# EAGLE design untitled (EAGLE 9.6.2)
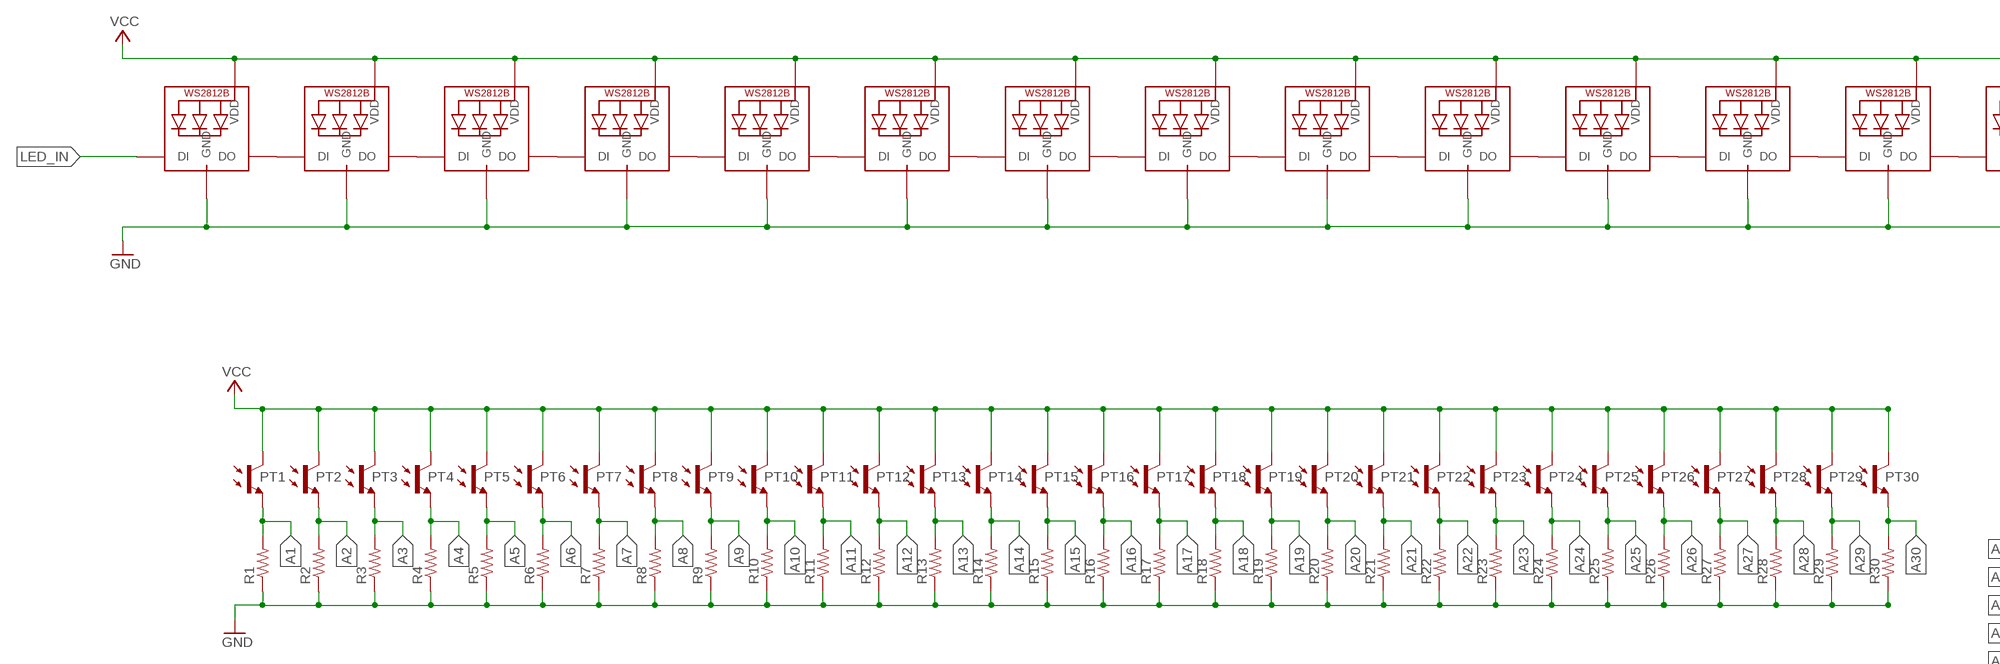
[diagram p0: schematic, sheet 1, part 1 of 2]
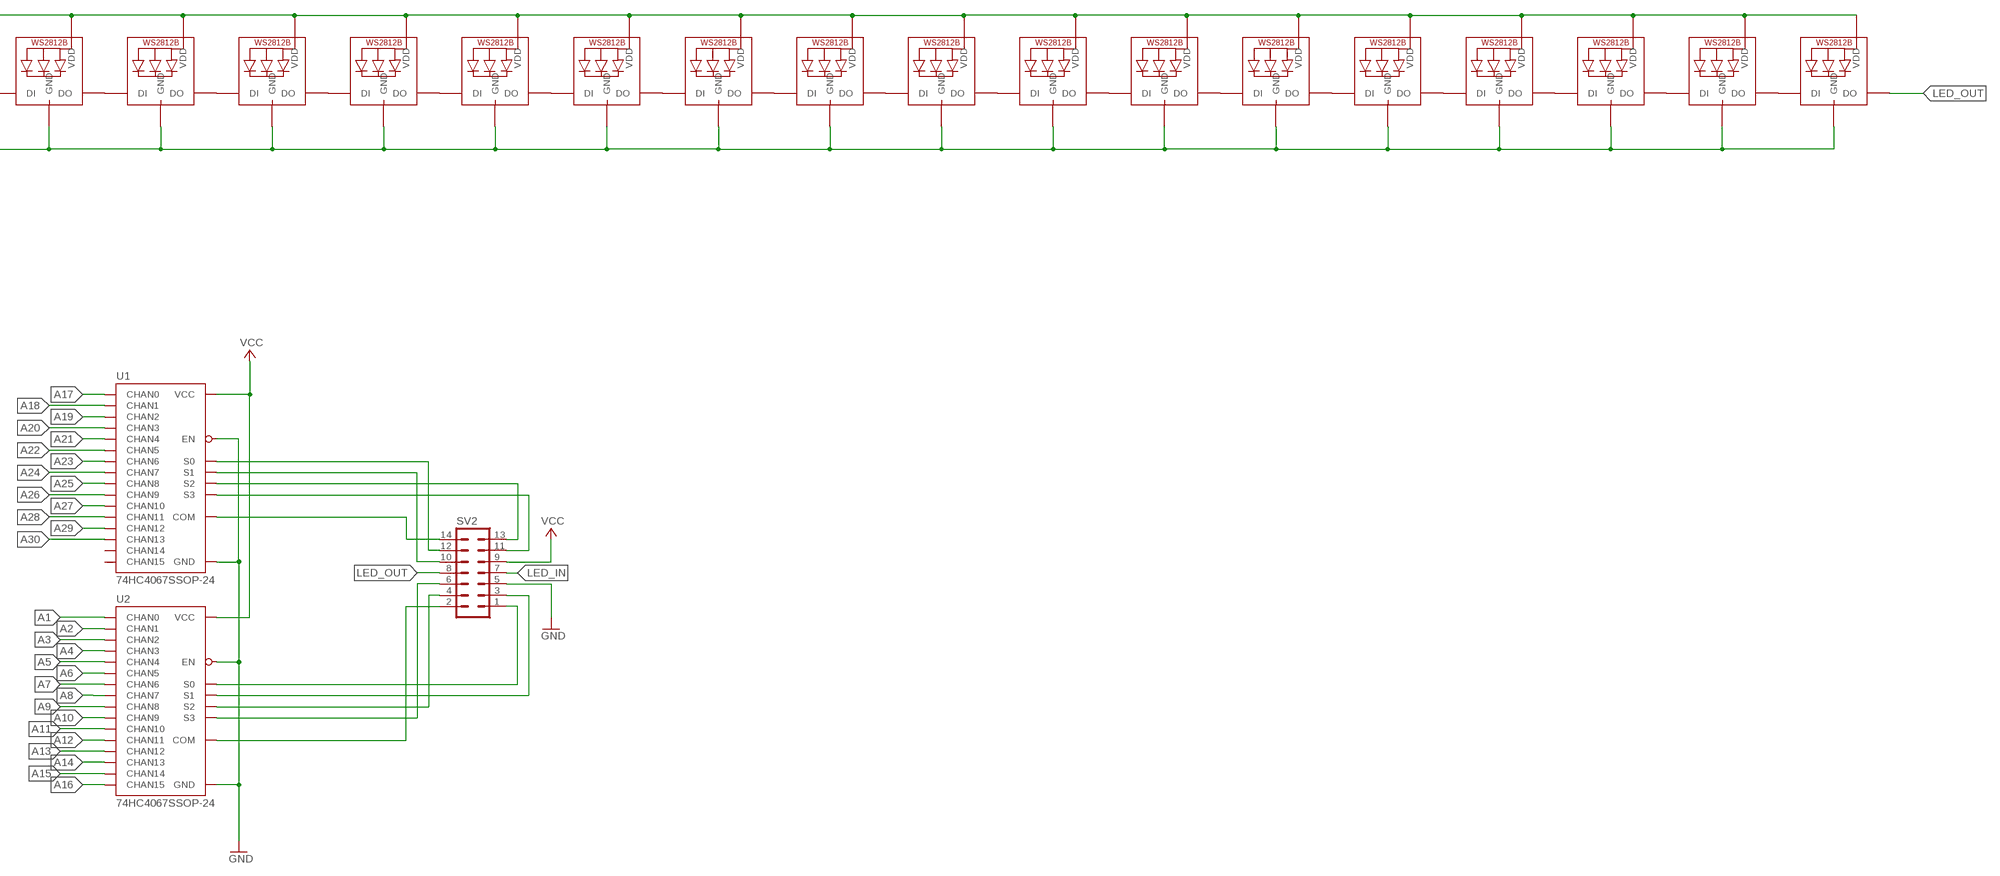
[diagram p1: schematic, sheet 1, part 2 of 2]

## Parts
LED1  WS2812B_5050N  [WS2812B-NARROW]
LED2  WS2812B_5050N  [WS2812B-NARROW]
LED3  WS2812B_5050N  [WS2812B-NARROW]
LED4  WS2812B_5050N  [WS2812B-NARROW]
LED5  WS2812B_5050N  [WS2812B-NARROW]
LED6  WS2812B_5050N  [WS2812B-NARROW]
LED7  WS2812B_5050N  [WS2812B-NARROW]
LED8  WS2812B_5050N  [WS2812B-NARROW]
LED9  WS2812B_5050N  [WS2812B-NARROW]
LED10  WS2812B_5050N  [WS2812B-NARROW]
LED11  WS2812B_5050N  [WS2812B-NARROW]
LED12  WS2812B_5050N  [WS2812B-NARROW]
LED13  WS2812B_5050N  [WS2812B-NARROW]
LED14  WS2812B_5050N  [WS2812B-NARROW]
LED15  WS2812B_5050N  [WS2812B-NARROW]
LED16  WS2812B_5050N  [WS2812B-NARROW]
LED17  WS2812B_5050N  [WS2812B-NARROW]
LED18  WS2812B_5050N  [WS2812B-NARROW]
LED19  WS2812B_5050N  [WS2812B-NARROW]
LED20  WS2812B_5050N  [WS2812B-NARROW]
LED21  WS2812B_5050N  [WS2812B-NARROW]
LED22  WS2812B_5050N  [WS2812B-NARROW]
LED23  WS2812B_5050N  [WS2812B-NARROW]
LED24  WS2812B_5050N  [WS2812B-NARROW]
LED25  WS2812B_5050N  [WS2812B-NARROW]
LED26  WS2812B_5050N  [WS2812B-NARROW]
LED27  WS2812B_5050N  [WS2812B-NARROW]
LED28  WS2812B_5050N  [WS2812B-NARROW]
LED29  WS2812B_5050N  [WS2812B-NARROW]
LED30  WS2812B_5050N  [WS2812B-NARROW]
PT1  TPS611  NJL7502L  [NJL7502L]
PT2  TPS611  NJL7502L  [NJL7502L]
PT3  TPS611  NJL7502L  [NJL7502L]
PT4  TPS611  NJL7502L  [NJL7502L]
PT5  TPS611  NJL7502L  [NJL7502L]
PT6  TPS611  NJL7502L  [NJL7502L]
PT7  TPS611  NJL7502L  [NJL7502L]
PT8  TPS611  NJL7502L  [NJL7502L]
PT9  TPS611  NJL7502L  [NJL7502L]
PT10  TPS611  NJL7502L  [NJL7502L]
PT11  TPS611  NJL7502L  [NJL7502L]
PT12  TPS611  NJL7502L  [NJL7502L]
PT13  TPS611  NJL7502L  [NJL7502L]
PT14  TPS611  NJL7502L  [NJL7502L]
PT15  TPS611  NJL7502L  [NJL7502L]
PT16  TPS611  NJL7502L  [NJL7502L]
PT17  TPS611  NJL7502L  [NJL7502L]
PT18  TPS611  NJL7502L  [NJL7502L]
PT19  TPS611  NJL7502L  [NJL7502L]
PT20  TPS611  NJL7502L  [NJL7502L]
PT21  TPS611  NJL7502L  [NJL7502L]
PT22  TPS611  NJL7502L  [NJL7502L]
PT23  TPS611  NJL7502L  [NJL7502L]
PT24  TPS611  NJL7502L  [NJL7502L]
PT25  TPS611  NJL7502L  [NJL7502L]
PT26  TPS611  NJL7502L  [NJL7502L]
PT27  TPS611  NJL7502L  [NJL7502L]
PT28  TPS611  NJL7502L  [NJL7502L]
PT29  TPS611  NJL7502L  [NJL7502L]
PT30  TPS611  NJL7502L  [NJL7502L]
R1  R-US_M2012  [M2012]
R2  R-US_M2012  [M2012]
R3  R-US_M2012  [M2012]
R4  R-US_M2012  [M2012]
R5  R-US_M2012  [M2012]
R6  R-US_M2012  [M2012]
R7  R-US_M2012  [M2012]
R8  R-US_M2012  [M2012]
R9  R-US_M2012  [M2012]
R10  R-US_M2012  [M2012]
R11  R-US_M2012  [M2012]
R12  R-US_M2012  [M2012]
R13  R-US_M2012  [M2012]
R14  R-US_M2012  [M2012]
R15  R-US_M2012  [M2012]
R16  R-US_M2012  [M2012]
R17  R-US_M2012  [M2012]
R18  R-US_M2012  [M2012]
R19  R-US_M2012  [M2012]
R20  R-US_M2012  [M2012]
R21  R-US_M2012  [M2012]
R22  R-US_M2012  [M2012]
R23  R-US_M2012  [M2012]
R24  R-US_M2012  [M2012]
R25  R-US_M2012  [M2012]
R26  R-US_M2012  [M2012]
R27  R-US_M2012  [M2012]
R28  R-US_M2012  [M2012]
R29  R-US_M2012  [M2012]
R30  R-US_M2012  [M2012]
SV2  MA07-2  [MA07-2]
U1  74HC4067SSOP-24  [SSOP24]
U2  74HC4067SSOP-24  [SSOP24]

## Nets
A1: PT1.E R1.2 U2.9(CHAN0)
A2: PT2.E R2.2 U2.8(CHAN1)
A3: PT3.E R3.2 U2.7(CHAN2)
A4: PT4.E R4.2 U2.6(CHAN3)
A5: PT5.E R5.2 U2.5(CHAN4)
A6: PT6.E R6.2 U2.4(CHAN5)
A7: PT7.E R7.2 U2.3(CHAN6)
A8: PT8.E R8.2 U2.2(CHAN7)
A9: PT9.E R9.2 U2.23(CHAN8)
A10: PT10.E R10.2 U2.22(CHAN9)
A11: PT11.E R11.2 U2.21(CHAN10)
A12: PT12.E R12.2 U2.20(CHAN11)
A13: PT13.E R13.2 U2.19(CHAN12)
A14: PT14.E R14.2 U2.18(CHAN13)
A15: PT15.E R15.2 U2.17(CHAN14)
A16: PT16.E R16.2 U2.16(CHAN15)
A17: PT17.E R17.2 U1.9(CHAN0)
A18: PT18.E R18.2 U1.8(CHAN1)
A19: PT19.E R19.2 U1.7(CHAN2)
A20: PT20.E R20.2 U1.6(CHAN3)
A21: PT21.E R21.2 U1.5(CHAN4)
A22: PT22.E R22.2 U1.4(CHAN5)
A23: PT23.E R23.2 U1.3(CHAN6)
A24: PT24.E R24.2 U1.2(CHAN7)
A25: PT25.E R25.2 U1.23(CHAN8)
A26: PT26.E R26.2 U1.22(CHAN9)
A27: PT27.E R27.2 U1.21(CHAN10)
A28: PT28.E R28.2 U1.20(CHAN11)
A29: PT29.E R29.2 U1.19(CHAN12)
A30: PT30.E R30.2 U1.18(CHAN13)
AIN0: SV2.14 U1.1(COM)
AIN1: SV2.2 U2.1(COM)
GND: LED1.3-GND(GND) LED2.3-GND(GND) LED3.3-GND(GND) LED4.3-GND(GND) LED5.3-GND(GND) LED6.3-GND(GND) LED7.3-GND(GND) LED8.3-GND(GND) LED9.3-GND(GND) LED10.3-GND(GND) LED11.3-GND(GND) LED12.3-GND(GND) LED13.3-GND(GND) LED14.3-GND(GND) LED15.3-GND(GND) LED16.3-GND(GND) LED17.3-GND(GND) LED18.3-GND(GND) LED19.3-GND(GND) LED20.3-GND(GND) LED21.3-GND(GND) LED22.3-GND(GND) LED23.3-GND(GND) LED24.3-GND(GND) LED25.3-GND(GND) LED26.3-GND(GND) LED27.3-GND(GND) LED28.3-GND(GND) LED29.3-GND(GND) LED30.3-GND(GND) R1.1 R2.1 R3.1 R4.1 R5.1 R6.1 R7.1 R8.1 R9.1 R10.1 R11.1 R12.1 R13.1 R14.1 R15.1 R16.1 R17.1 R18.1 R19.1 R20.1 R21.1 R22.1 R23.1 R24.1 R25.1 R26.1 R27.1 R28.1 R29.1 R30.1 SV2.5 U1.12(GND) U1.15(EN) U2.12(GND) U2.15(EN)
LED_IN: LED1.4-DIN(DI) SV2.7
LED_OUT: LED30.2-DOUT(DO) SV2.8
N$1: LED1.2-DOUT(DO) LED2.4-DIN(DI)
N$2: LED2.2-DOUT(DO) LED3.4-DIN(DI)
N$3: LED3.2-DOUT(DO) LED4.4-DIN(DI)
N$4: LED4.2-DOUT(DO) LED5.4-DIN(DI)
N$6: LED6.2-DOUT(DO) LED7.4-DIN(DI)
N$8: SV2.13 U1.14(S2)
N$9: SV2.11 U1.13(S3)
N$10: SV2.6 U2.13(S3)
N$11: SV2.4 U2.14(S2)
N$12: LED7.2-DOUT(DO) LED8.4-DIN(DI)
N$13: SV2.3 U2.11(S1)
N$14: SV2.1 U2.10(S0)
N$15: SV2.10 U1.11(S1)
N$16: SV2.12 U1.10(S0)
N$37: LED8.2-DOUT(DO) LED9.4-DIN(DI)
N$38: LED9.2-DOUT(DO) LED10.4-DIN(DI)
N$39: LED5.2-DOUT(DO) LED6.4-DIN(DI)
N$40: LED11.2-DOUT(DO) LED12.4-DIN(DI)
N$41: LED12.2-DOUT(DO) LED13.4-DIN(DI)
N$42: LED13.2-DOUT(DO) LED14.4-DIN(DI)
N$43: LED14.2-DOUT(DO) LED15.4-DIN(DI)
N$44: LED10.2-DOUT(DO) LED11.4-DIN(DI)
N$45: LED16.2-DOUT(DO) LED17.4-DIN(DI)
N$46: LED17.2-DOUT(DO) LED18.4-DIN(DI)
N$47: LED18.2-DOUT(DO) LED19.4-DIN(DI)
N$48: LED19.2-DOUT(DO) LED20.4-DIN(DI)
N$49: LED15.2-DOUT(DO) LED16.4-DIN(DI)
N$50: LED21.2-DOUT(DO) LED22.4-DIN(DI)
N$51: LED22.2-DOUT(DO) LED23.4-DIN(DI)
N$52: LED23.2-DOUT(DO) LED24.4-DIN(DI)
N$53: LED24.2-DOUT(DO) LED25.4-DIN(DI)
N$54: LED20.2-DOUT(DO) LED21.4-DIN(DI)
N$55: LED26.2-DOUT(DO) LED27.4-DIN(DI)
N$56: LED27.2-DOUT(DO) LED28.4-DIN(DI)
N$57: LED28.2-DOUT(DO) LED29.4-DIN(DI)
N$58: LED29.2-DOUT(DO) LED30.4-DIN(DI)
N$59: LED25.2-DOUT(DO) LED26.4-DIN(DI)
VCC: LED1.1-VDD(VDD) LED2.1-VDD(VDD) LED3.1-VDD(VDD) LED4.1-VDD(VDD) LED5.1-VDD(VDD) LED6.1-VDD(VDD) LED7.1-VDD(VDD) LED8.1-VDD(VDD) LED9.1-VDD(VDD) LED10.1-VDD(VDD) LED11.1-VDD(VDD) LED12.1-VDD(VDD) LED13.1-VDD(VDD) LED14.1-VDD(VDD) LED15.1-VDD(VDD) LED16.1-VDD(VDD) LED17.1-VDD(VDD) LED18.1-VDD(VDD) LED19.1-VDD(VDD) LED20.1-VDD(VDD) LED21.1-VDD(VDD) LED22.1-VDD(VDD) LED23.1-VDD(VDD) LED24.1-VDD(VDD) LED25.1-VDD(VDD) LED26.1-VDD(VDD) LED27.1-VDD(VDD) LED28.1-VDD(VDD) LED29.1-VDD(VDD) LED30.1-VDD(VDD) PT1.C PT2.C PT3.C PT4.C PT5.C PT6.C PT7.C PT8.C PT9.C PT10.C PT11.C PT12.C PT13.C PT14.C PT15.C PT16.C PT17.C PT18.C PT19.C PT20.C PT21.C PT22.C PT23.C PT24.C PT25.C PT26.C PT27.C PT28.C PT29.C PT30.C SV2.9 U1.24(VCC) U2.24(VCC)
Unconnected: U1.16(CHAN15) U1.17(CHAN14)

## Library data of the parts
LED1-LED30 = adafruit:WS2812B
PT1-PT30 = by_hirame:NJL7502L
R1-R30 = adafruit:R-US_: RESISTOR, American symbol
SV2 = con-lstb:MA07-2: PIN HEADER; OC_FARNELL: unknown; OC_NEWARK: unknown
U1 U2 = 74HC4067:74HC4067: Check availability <https://pricing.snapeda.com/parts/74HC4067/Nexperia/view-part?ref=eda>; AVAILABILITY: In Stock; DESCRIPTION: Analog Switch/Analog Multiplexer Single 16:1 24-Pin SSOP T/R; MF: Nexperia; MP: 74HC4067; PACKAGE: None; PRICE: None; PURCHASE-URL: https://pricing.snapeda.com/search/part/74HC4067/?ref=eda

## Board
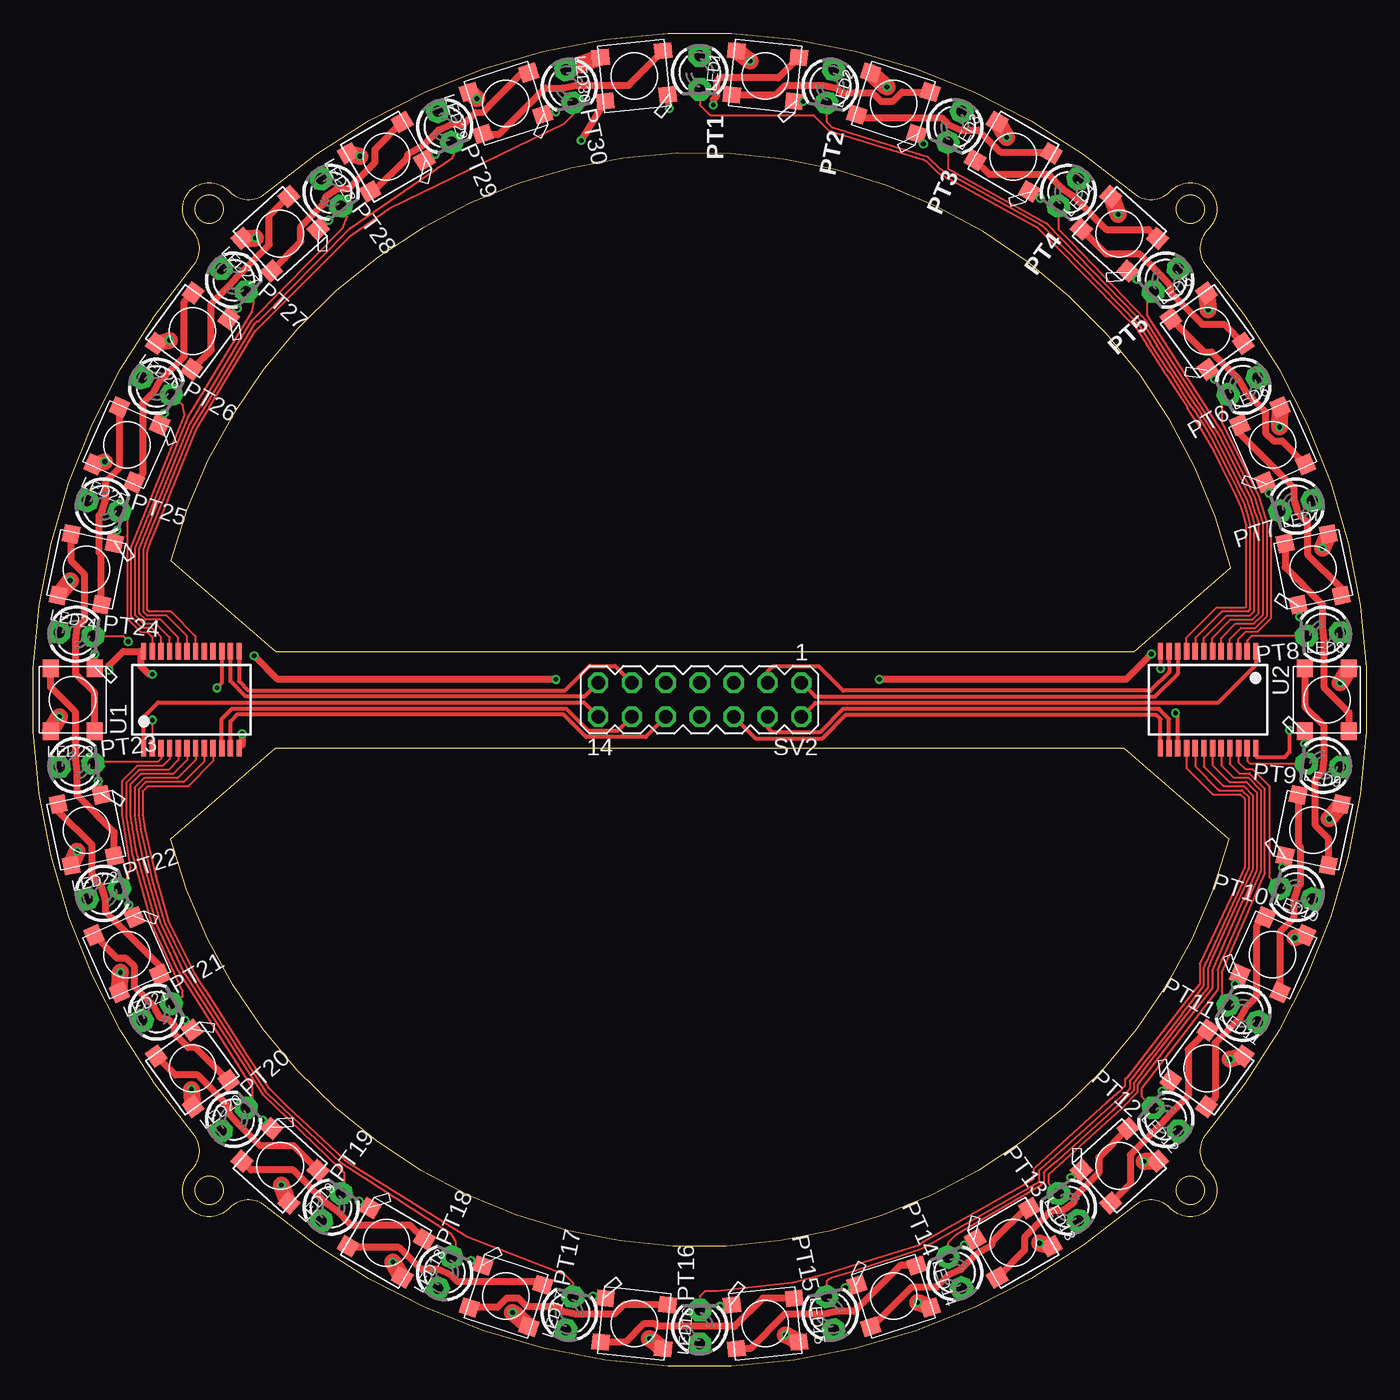
[diagram p2: board, top side]
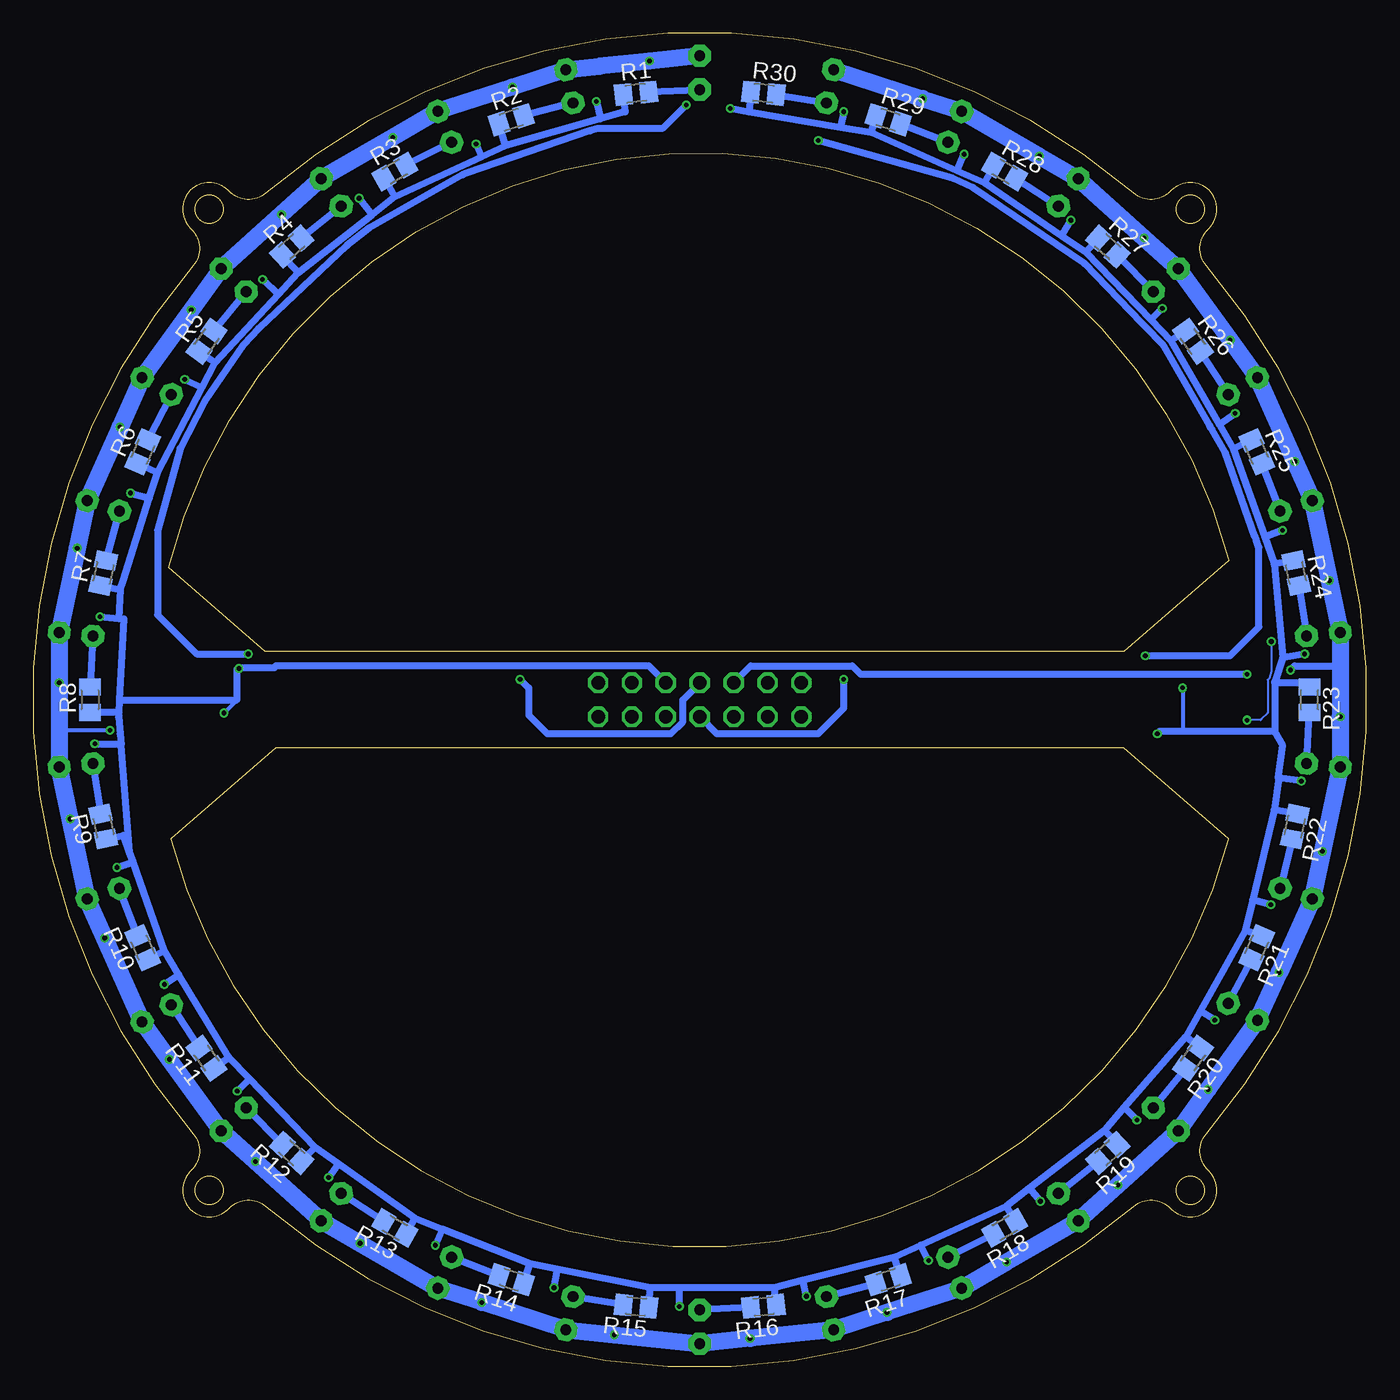
[diagram p3: board, bottom side, seen from below]

Size 99.89 x 99.89 mm. Coordinates in mm from the lower left corner, seen from the top.
Outline: 87.91,82.48 arc-81 87.91,17.41 arc86 88.02,14.7 88.13,14.59 arc-180 85.3,11.76 85.19,11.87 arc86 82.48,11.97 arc-81 17.41,11.97 arc86 14.7,11.87 14.59,11.76 arc-180 11.76,14.59 11.87,14.7 arc86 11.97,17.41 arc-81 11.97,82.48 arc86 11.87,85.19 11.76,85.3 arc-180 14.59,88.13 14.7,88.02 arc86 17.41,87.91 arc-81 82.48,87.91 arc86 85.19,88.02 85.3,88.13 arc-180 88.13,85.3 88.02,85.19 arc86 87.91,82.48
Outline: 18.14,53.54 82.52,53.54 89.73,59.84 arc151 10.3,60.39 18.14,53.54
Outline: 89.59,39.5 arc-150 10.3,39.5 18.14,46.34 81.75,46.34 89.59,39.5
Outline: circle at 13.18,86.71 radius 1.05
Outline: circle at 13.18,13.18 radius 1.05
Outline: circle at 86.71,13.18 radius 1.05
Outline: circle at 86.71,86.71 radius 1.05
Copper layers (1*16): Top 0.035mm / dielectric 1.6mm / Bottom 0.035mm
Design rules "Elecrow_2-layer_PCB_eagle_rule": minimum track width 6mil, minimum drill 12mil, track to track 6mil, track to pad 6mil, pad to pad 6mil, via to via 8mil, smd to smd 0mil, copper to edge 20mil, drill to drill 10mil, minimum pad ring 6mil, minimum via ring 6mil, stop-mask expansion 0mil, vias tented up to drill 100mil, thermal gap 10mil

### Footprints (pad centres in the part's own frame; a part is rotated, then mirrored left to right if it is on the bottom)
WS2812B-NARROW = smd 1.3 x 1.2: 1-VDD 2.35,-1.65; 2-DOUT 2.35,1.65; 3-GND -2.35,1.65; 4-DIN -2.35,-1.65
NJL7502L = drill 0.813 pad 1.676 octagon: C -1.27,0; E 1.27,0
M2012 = smd 1.3 x 1.6: 1 -0.95,0; 2 0.95,0
MA07-2 = drill 1.016 octagon: 1 -7.62,-1.27; 2 -7.62,1.27; 3 -5.08,-1.27; 4 -5.08,1.27; 5 -2.54,-1.27; 6 -2.54,1.27; 7 0,-1.27; 8 0,1.27; 9 2.54,-1.27; 10 2.54,1.27; 11 5.08,-1.27; 12 5.08,1.27; 13 7.62,-1.27; 14 7.62,1.27
SSOP24 = smd 0.4 x 1.25: 1 -3.575,-3.625; 2 -2.925,-3.625; 3 -2.275,-3.625; 4 -1.625,-3.625; 5 -0.975,-3.625; 6 -0.325,-3.625; 7 0.325,-3.625; 8 0.975,-3.625; 9 1.625,-3.625; 10 2.275,-3.625; 11 2.925,-3.625; 12 3.575,-3.625; 13 3.575,3.625; 14 2.925,3.625; 15 2.275,3.625; 16 1.625,3.625; 17 0.975,3.625; 18 0.325,3.625; 19 -0.325,3.625; 20 -0.975,3.625; 21 -1.625,3.625; 22 -2.275,3.625; 23 -2.925,3.625; 24 -3.575,3.625

### Placement (x,y rotation side)
LED1  54.86,96.69 174 top
LED2  64.47,94.64 162 top
LED3  73.44,90.65 150 top
LED4  81.39,84.87 138 top
LED5  87.97,77.57 126 top
LED6  92.88,69.06 114 top
LED7  95.92,59.72 102 top
LED8  96.94,49.94 90 top
LED9  95.92,40.17 78 top
LED10  92.88,30.83 66 top
LED11  87.97,22.32 54 top
LED12  81.39,15.02 42 top
LED13  73.44,9.24 30 top
LED14  64.47,5.25 18 top
LED15  54.86,3.2 6 top
LED16  45.03,3.2 354 top
LED17  35.42,5.25 342 top
LED18  26.44,9.24 330 top
LED19  18.5,15.02 318 top
LED20  11.92,22.32 306 top
LED21  7.01,30.83 294 top
LED22  3.97,40.17 282 top
LED23  2.94,49.94 270 top
LED24  3.97,59.72 258 top
LED25  7.01,69.06 246 top
LED26  11.92,77.57 234 top
LED27  18.5,84.87 222 top
LED28  26.44,90.65 210 top
LED29  35.42,94.64 198 top
LED30  45.03,96.69 186 top
PT1  49.94,96.94 270 top
PT2  59.72,95.92 258 top
PT3  69.06,92.88 246 top
PT4  77.57,87.97 234 top
PT5  84.87,81.39 222 top
PT6  90.65,73.44 210 top
PT7  94.64,64.47 198 top
PT8  96.69,54.86 186 top
PT9  96.69,45.03 174 top
PT10  94.64,35.42 162 top
PT11  90.65,26.44 150 top
PT12  84.87,18.5 138 top
PT13  77.57,11.92 126 top
PT14  69.06,7.01 114 top
PT15  59.72,3.97 102 top
PT16  49.94,2.94 90 top
PT17  40.17,3.97 78 top
PT18  30.83,7.01 66 top
PT19  22.32,11.92 54 top
PT20  15.02,18.5 42 top
PT21  9.24,26.54 30 top
PT22  5.25,35.42 18 top
PT23  3.2,45.03 6 top
PT24  3.2,54.86 354 top
PT25  5.25,64.47 342 top
PT26  9.24,73.44 330 top
PT27  15.02,81.39 318 top
PT28  22.32,87.97 306 top
PT29  30.83,92.88 294 top
PT30  40.17,95.92 282 top
R1  54.72,95.39 6 bottom
R2  64.07,93.41 18 bottom
R3  72.79,89.52 30 bottom
R4  80.52,83.91 42 bottom
R5  86.92,76.81 54 bottom
R6  91.69,68.53 66 bottom
R7  94.65,59.45 78 bottom
R8  95.64,49.94 90 bottom
R9  94.65,40.44 102 bottom
R10  91.69,31.36 114 bottom
R11  86.92,23.08 126 bottom
R12  80.52,15.98 138 bottom
R13  72.79,10.37 150 bottom
R14  64.07,6.48 162 bottom
R15  54.72,4.5 174 bottom
R16  45.17,4.5 186 bottom
R17  35.82,6.48 198 bottom
R18  27.09,10.37 210 bottom
R19  19.37,15.98 222 bottom
R20  12.97,23.08 234 bottom
R21  8.2,31.36 246 bottom
R22  5.34,40.44 258 bottom
R23  4.24,49.94 270 bottom
R24  5.24,59.45 282 bottom
R25  8.2,68.53 294 bottom
R26  12.97,76.81 306 bottom
R27  19.37,83.91 318 bottom
R28  27.09,89.52 330 bottom
R29  35.82,93.41 342 bottom
R30  45.17,95.39 354 bottom
SV2  49.94,49.94 180 top
U1  11.84,49.94 0 top
U2  88.04,49.94 180 top

### Tracks (layer width: path | path; a pad name or v marks a point on that pad's centre or on a via)
A1
  Top 0.152: 90.11,65.26 90.18,65.12 90.46,64.49 90.65,63.9 90.85,63.24 90.91,63.02 90.91,62.27 90.91,62.26 90.91,56.93 90.84,56.86 88.66,56.86 86.42,54.62 U2.9 | 90.11,65.26 | 90.11,65.26 89.48,66.53 88.95,67.58 88.46,68.57 88.26,68.96 87.37,70.48 87.29,70.6 | 87.21,70.72 87.29,70.6 | 87.29,70.6 87.21,70.68 87.21,70.72 | 87.21,70.72 86.61,71.65 86.47,71.85 86.48,71.86 85.74,73 84.91,74.29 84.82,74.38 84.82,74.41 84.81,74.42 84.75,74.48 84.75,74.52 83.49,76.47 83.42,76.54 83.42,76.58 83.4,76.61 83.41,76.63 83.23,76.9 82.85,77.48 82.61,77.86 82.15,78.33 79.76,80.79 75.6,85 75.26,85.33 75,85.47 | 75,85.47 | 75,85.47 67.79,89.45 66.94,90.31 66.73,90.42 64.75,91.03 60.36,92.36 59.75,92.57 59.65,92.57 58.45,93.76 50.71,93.76 49.94,94.52 PT1.E
  Bottom 0.508: PT1.E 49.98,95.64 R1.2
A2
  Top 0.152: 91.08,63.53 91.22,63.07 91.22,62.39 91.22,56.73 91.05,56.55 89.07,56.55 87.07,54.56 U2.8 | 91.08,63.53 | 91.08,63.53 91.06,63.6 90.9,64.11 90.83,64.35 90.8,64.47 90.78,64.53 90.46,65.25 90.33,65.5 89.7,66.78 89.21,67.74 88.68,68.81 88.48,69.21 88.4,69.36 87.9,70.22 86.93,71.71 86.87,71.82 86.8,71.92 86.02,73.13 85.93,73.27 85.12,74.52 | 85.12,74.52 85.1,74.56 85.05,74.61 83.73,76.67 83.73,76.69 83.41,77.18 82.96,77.88 82.85,78.05 75.85,85.25 75.61,85.49 75.44,85.58 67.98,89.7 67.03,90.65 59.85,92.87 59.45,93.27 PT2.E | 85.12,74.52
  Bottom 0.508: PT2.E R2.2
A3
  Top 0.152: U2.7 87.72,54.57 89.4,56.25 91.17,56.25 91.52,56.6 91.52,62.52 91.52,63.11 91.31,63.81 91.1,64.51 | PT3.E 68.54,89.76 75.98,85.63 82.7,78.65 83.09,78.24 83.22,78.05 84.11,76.65 84.17,76.57 84.24,76.45 84.87,75.47 85.34,74.76 87.12,71.98 | 91.1,64.51 | 91.1,64.51 91,64.85 90.94,64.97 90.33,66.2 90.27,66.3 89.17,68.5 89,68.84 88.6,69.65 88.36,70.04 88.15,70.38 87.12,71.98 | 87.12,71.98
  Bottom 0.508: PT3.E R3.2
A4
  Top 0.152: U2.6 88.37,54.59 89.73,55.94 91.35,55.94 91.83,56.43 91.83,62.64 91.83,63.16 91.69,63.61 91.59,63.93 91.29,64.96 91.16,65.22 89.3,68.94 88.87,69.79 88.75,70.02 88.52,70.37 | 88.52,70.37 | 88.52,70.37 85.53,75.02 | 85.53,75.02 | 85.53,75.02 84.44,76.71 | 84.44,76.71 | 84.44,76.71 83.33,78.43 77.85,84.2 76.82,85.23 PT4.E
  Bottom 0.508: PT4.E R4.2
A5
  Top 0.152: U2.5 89.02,54.56 90.1,55.64 91.47,55.64 92.13,56.3 92.13,63.19 91.92,63.9 | PT5.E 83.47,80.09 83.47,78.77 89.04,70.13 91.05,66.12 91.57,65.07 91.92,63.9 | 91.92,63.9
  Bottom 0.508: PT5.E R5.2
A6
  Top 0.152: PT6.E 89.06,72.32 89.06,70.77 91.85,65.18 92.44,63.24 92.44,56.17 91.6,55.33 90.51,55.33 89.67,54.49 U2.4
  Bottom 0.508: PT6.E R6.2
A7
  Top 0.152: PT7.E 92.74,63.38 92.74,56.04 91.73,55.03 90.84,55.03 90.32,54.51 U2.3
  Bottom 0.508: PT7.E R7.2
A8
  Top 0.152: PT8.E 91.3,54.72 90.97,54.39 U2.2
  Bottom 0.508: PT8.E R8.2
A9
  Top 0.152: U2.23 90.97,45.37 91.17,45.16 PT9.E
  Bottom 0.508: PT9.E R9.2
A10
  Top 0.152: U2.22 90.32,45.26 90.84,44.74 91.35,44.74 92.62,43.47 92.62,36.63 PT10.E
  Bottom 0.508: R10.2 PT10.E
A11
  Top 0.152: PT11.E 89.06,27.57 89.06,29.5 92.31,36.94 92.31,43.26 91.14,44.43 90.38,44.43 89.67,45.14 U2.21
  Bottom 0.508: PT11.E R11.2
A12
  Top 0.152: U2.20 89.02,45.03 89.95,44.1 91.04,44.1 92.01,43.14 92.01,37.13 91.04,34.91 89.19,30.68 88.76,29.69 88.76,28.23 83.09,20.86 83.09,20.18 PT12.E
  Bottom 0.508: PT12.E R12.2
A13
  Top 0.152: U2.19 88.37,45.05 89.62,43.8 90.92,43.8 91.7,43.01 91.7,37.24 91.66,37.1 90.83,35.2 | 90.83,35.2 | 90.83,35.2 90.71,34.92 90.66,34.87 88.37,29.63 88.37,28.36 88.36,28.34 88.25,28.2 87.19,26.84 87.16,26.78 83.29,21.75 82.86,21.19 82.77,21.1 82.77,20.54 81.57,19.34 76.11,14.38 76.11,13.67 PT13.E
  Bottom 0.508: PT13.E R13.2
A14
  Top 0.152: U2.18 87.72,44.94 89.19,43.47 90.71,43.47 91.4,42.78 91.4,37.29 91.37,37.2 91.13,36.65 88.22,30.24 | 88.22,30.24 88.05,29.86 | 88.22,30.24 | 88.05,29.86 | 88.05,29.86 88.05,29.65 88.04,29.64 88.04,28.43 86.9,26.96 86.79,26.8 84.14,23.35 83.05,21.94 82.98,21.84 82.63,21.39 82.47,21.23 82.47,20.67 81.36,19.56 80.96,19.2 76.74,15.4 75.85,14.64 75.73,14.51 75.73,13.75 75.47,13.5 69.12,9.81 68.54,9.24 PT14.E
  Bottom 0.508: R14.2 PT14.E
A15
  Top 0.152: U2.17 87.07,44.95 88.86,43.16 90.58,43.16 91.09,42.65 91.09,37.33 91.09,37.31 90.92,36.94 90.59,36.2 88.16,30.84 87.9,30.27 87.85,30.16 87.8,30.06 87.72,29.88 87.72,28.51 86.73,27.24 86.72,27.24 86.66,27.14 86.58,27.04 86.55,26.98 86.17,26.49 85.93,26.17 | 85.93,26.17 | 85.93,26.17 83.94,23.6 83.75,23.34 83.42,22.92 82.4,21.59 82.16,21.35 82.16,20.8 81.9,20.53 81.89,20.52 75.47,14.77 75.34,14.64 75.34,13.8 75.28,13.74 74.58,13.33 68.87,10.07 66.58,8.8 61.63,7.15 59.85,6.64 59.47,6.38 59.45,6.37 PT15.E
  Bottom 0.508: R15.2 PT15.E
A16
  Top 0.152: U2.16 86.42,44.84 88.4,42.86 90.46,42.86 90.79,42.53 90.79,37.39 90.65,37.06 90.32,36.33 90.05,35.73 89.44,34.45 89.43,34.44 87.41,30.16 87.41,28.63 87.01,28.16 81.95,21.62 81.82,21.5 81.82,20.99 81.44,20.61 80.42,19.72 75.09,14.89 74.96,14.77 74.96,14 74.33,13.62 66.71,9.3 66.4,9.06 66.03,8.93 59.34,6.89 56.93,6.26 51.21,5.62 50.33,5.62 49.94,5.24 PT16.E
  Bottom 0.508: R16.2 PT16.E
A17
  Top 0.152: 12.86,28.18 12.8,28.28 12.45,28.83 12.08,29.41 10.63,32.31 10.19,33.21 10.1,33.42 9.98,33.81 9.27,36.33 9.17,36.72 8.35,40.24 8.34,40.31 8.19,41.3 8.19,43.09 8.56,43.46 11.59,43.46 13.47,45.35 U1.9 | 12.86,28.18 | 12.86,28.18 15.85,23.55 15.9,23.47 15.96,23.4 15.96,23.37 16.7,22.23 17.59,20.88 18.97,19.5 23.32,15.44 23.99,15.01 32.55,9.69 39.82,6.87 40.44,6.26 PT17.E
  Bottom 0.508: R17.2 PT17.E
A18
  Top 0.152: 15.66,23.28 12.54,28.12 12.19,28.67 11.66,29.5 10.55,31.77 9.92,33.08 9.81,33.31 9.68,33.72 8.92,36.42 8.05,40.18 8.04,40.25 7.88,41.27 7.88,43.21 8.44,43.77 11.26,43.77 12.82,45.33 U1.8 | 15.66,23.28 | 15.66,23.28 17.42,20.55 17.59,20.39 23.02,15.27 31.28,9.94 31.66,9.3 31.66,8.48 PT18.E
  Bottom 0.508: R18.2 PT18.E
A19
  Top 0.152: PT19.E 23.27,13.16 23.27,14.51 23.02,14.77 17.18,20.35 11.97,28.44 11.28,29.52 9.64,32.95 9.5,33.27 8.38,37.21 8.36,37.29 8.36,37.38 8.33,37.41 8.32,37.43 7.74,40.2 7.58,41.25 7.58,43.36 8.29,44.07 10.8,44.07 12.17,45.44 U1.7
  Bottom 0.508: PT19.E R19.2
A20
  Top 0.152: 8.06,37.25 7.66,38.67 7.27,41.23 7.27,43.59 8.06,44.38 10.47,44.38 11.52,45.43 U1.6 | 8.06,37.25 | 8.06,37.25 9.21,33.16 10.79,29.73 16.42,20.86 16.42,19.8 PT20.E
  Bottom 0.508: R20.2 PT20.E
A21
  Top 0.152: PT21.E 11.21,27.72 11.21,28.1 8.92,33.05 7.36,38.6 6.97,41.2 6.97,43.72 7.93,44.68 10.14,44.68 10.87,45.41 U1.5
  Bottom 0.508: PT21.E R21.2
A22
  Top 0.152: PT22.E 6.78,35.91 7.24,37.32 6.66,41.18 6.66,43.87 7.78,44.99 9.71,44.99 10.23,45.51 10.22,45.52 U1.4
  Bottom 0.508: R22.2 PT22.E
A23
  Top 0.152: PT23.E 4.59,45.29 9.33,45.29 9.57,45.54 U1.3
  Bottom 0.508: PT23.E R23.2
A24  (via drill 0.35)
  Top 0.152: PT24.E 6.73,54.72 7.1,54.36 v7.1,54.31 | v8.92,48.42 U1.2
  Bottom 0.152: v7.1,54.31 7.1,52.06 7.28,51.54 7.37,51.44 7.37,48.95 7.84,48.48 7.91,48.42 v8.92,48.42
  Bottom 0.508: R24.2 PT24.E
A25
  Top 0.152: PT25.E 7.02,63.51 7.02,62.26 7.04,62.23 7.02,62.13 7.02,56.04 8.03,55.02 8.54,55.02 8.92,54.65 U1.23
  Bottom 0.508: PT25.E R25.2
A26
  Top 0.152: U1.22 9.57,54.63 8.87,55.33 8.16,55.33 7.32,56.17 7.32,57.56 7.32,57.69 7.32,61.37 11.34,71.28 11.21,72.04 PT26.E
  Bottom 0.508: R26.2 PT26.E
A27
  Top 0.152: U1.21 10.22,54.62 9.2,55.63 8.29,55.63 7.63,56.29 7.63,61.32 8.15,62.6 11.61,71.13 16.42,79.03 16.54,79.79 PT27.E
  Bottom 0.508: R27.2 PT27.E
A28
  Top 0.152: U1.20 10.87,54.6 9.53,55.94 8.42,55.94 7.93,56.42 7.93,61.26 8.15,61.79 11.67,70.48 16.36,78.35 23.19,85.3 23.53,86.14 PT28.E
  Bottom 0.508: R28.2 PT28.E
A29
  Top 0.152: U1.19 11.52,54.71 9.99,56.24 8.54,56.24 8.24,56.55 8.24,61.2 8.27,61.28 8.44,61.69 9.74,64.91 | 9.74,64.91 | 9.74,64.91 11.94,70.34 12.87,71.89 | 12.87,71.89 | 12.87,71.89 16.61,78.16 16.76,78.31 16.89,78.31 23.72,85.3 31.4,90.58 31.66,91.09 PT29.E
  Bottom 0.508: R29.2 PT29.E
A30
  Top 0.152: U1.18 12.17,54.7 10.32,56.55 8.67,56.55 8.54,56.68 8.54,60.99 8.6,61.28 8.73,61.6 | 8.73,61.6 | 8.73,61.6 | 8.73,61.6 9.98,64.68 10.02,64.79 10.07,64.84 10.07,64.91 12.22,70.2 13.05,71.6 | 13.05,71.6 | 13.05,71.6 13.11,71.7 13.19,71.78 13.19,71.84 16.62,77.59 20.1,81.06 23.78,84.74 26.7,86.77 39.78,93.12 40.55,93.89 PT30.E
  Bottom 0.508: R30.2 PT30.E
AIN0
  Top 0.305: U1.1 8.27,48.66 9.35,49.74 41.05,49.74 41.26,49.74 SV2.14
AIN1
  Top 0.305: U2.1 91.62,52.55 88.78,49.72 58.83,49.72 58.61,49.72 SV2.2
GND  (via drill 0.35)
  Top 0.305: U2.15 85.77,48.79 v85.61,48.95 | U1.15 14.12,51.2 v13.75,50.83 | U2.12 84.49,52.48 v84.49,52.29
  Top 0.406: 15.65,46.55 U1.12
  Top 0.508: LED1.3-GND v57.69,94.78 | LED2.3-GND v66.71,91.6 | LED3.3-GND v75.47,87.54 | LED4.3-GND v82.71,81.44 | LED5.3-GND v88.55,73.95 | LED6.3-GND v92.62,65.44 | LED7.3-GND v94.9,56.17 | LED8.3-GND v95.28,46.64 | LED9.3-GND v93.63,37.37 | LED11.3-GND v84.62,20.61 | LED12.3-GND v77.76,14.13 | LED13.3-GND v69.76,9.05 | LED14.3-GND v60.87,5.88 | LED15.3-GND v51.47,4.48 | LED16.3-GND v41.94,5.24 | LED18.3-GND v24.42,12.35 | LED19.3-GND v17.18,18.45 | LED20.3-GND v11.34,25.94 | LED21.3-GND v7.15,34.58 | LED22.3-GND v4.86,43.85 | LED24.3-GND v6.26,62.64 | LED25.3-GND v9.81,71.41 | LED26.3-GND v15.27,79.28 | LED27.3-GND v22.13,85.89 | LED28.3-GND v30.13,90.84 | LED29.3-GND v39.15,94.01 | LED30.3-GND v47.66,94.27 | LED10.3-GND v90.08,28.61 | LED17.3-GND v32.8,7.91 | LED23.3-GND 4.59,53.36 v4.61,53.37 | v15.65,47.4 15.65,46.55
  Bottom 0.152: v84.49,52.29 84.62,52.23
  Bottom 0.305: 93.29,47.4 93.39,47.38 | 93.29,47.4 93.52,48.99 | 93.51,48.93 93.29,47.4 | v85.61,48.95 84.62,49.94 | 84.62,49.94 | v13.75,50.83 13.75,47.58 | v84.49,52.29 84.49,52.36
  Bottom 0.508: R1.1 55.72,95.31 55.53,94.01 57.4,93.49 | 57.4,93.49 64.51,91.49 | 64.51,91.49 R2.1 | v57.69,94.78 57.4,93.49 | R3.1 72.8,87.66 | 72.8,87.66 66.3,90.66 | 66.3,90.66 64.51,91.49 | R4.1 80.04,81.95 | 80.04,81.95 74.52,86.31 | 74.52,86.31 72.8,87.66 | v66.71,91.6 66.3,90.66 | v75.47,87.54 74.52,86.31 | R5.1 86.27,75.22 | 86.27,75.22 81.51,80.36 | 81.51,80.36 80.04,81.95 | v82.71,81.44 81.51,80.36 | R6.1 90.58,66.96 | 90.58,66.96 87.24,73.36 | 87.24,73.36 86.27,75.22 | v88.55,73.95 87.24,73.36 | R7.1 93.38,58.2 | 93.38,58.2 93.17,58.85 91.19,65.05 | 91.19,65.05 90.58,66.96 | v92.62,65.44 91.19,65.05 | 93.38,58.2 93.5,56.04 | 93.45,49.96 93.11,56.01 93.5,56.04 | 93.45,49.96 93.51,48.93 | R8.1 93.52,48.99 93.49,48.64 93.39,47.38 93.32,46.51 | v94.9,56.17 93.5,56.04 | R9.1 93.12,39.78 92.66,38.45 | 92.66,38.45 93.32,46.51 | v95.28,46.64 93.33,46.64 93.32,46.51 | R10.1 90.08,31.15 | 90.08,31.15 92.42,37.78 | 92.42,37.78 92.66,38.45 | v93.63,37.37 92.42,37.78 | R11.1 85.25,23.15 | 85.25,23.15 88.99,29.34 | 88.99,29.34 90.08,31.15 | R12.1 78.77,16.42 | 78.77,16.42 83.69,21.53 | 83.69,21.53 85.25,23.15 | v84.62,20.61 83.69,21.53 | R13.1 71.28,11.08 | 71.28,11.08 76.99,15.15 | 76.99,15.15 78.77,16.42 | v77.76,14.13 76.99,15.15 | R14.1 62.64,7.65 | 62.64,7.65 69.22,10.26 | 69.22,10.26 71.28,11.08 | v69.76,9.05 69.22,10.26 | R15.1 53.63,5.88 | 53.63,5.88 60.59,7.25 | 60.59,7.25 62.64,7.65 | v60.87,5.88 60.59,7.25 | R16.1 44.36,5.88 | 44.36,5.88 51.47,5.88 | 51.47,5.88 53.63,5.88 | v51.47,4.48 51.47,5.88 | R17.1 35.34,8.16 | 35.34,8.16 42.21,6.42 | 42.21,6.42 44.36,5.88 | v41.94,5.24 42.21,6.42 | R18.1 26.96,11.97 | 26.96,11.97 33.37,9.06 | 33.37,9.06 35.34,8.16 | R19.1 19.59,17.69 | 19.59,17.69 25.23,13.31
  Bottom 0.508: 25.23,13.31 26.96,11.97 | v24.42,12.35 25.23,13.31 | R20.1 13.5,24.67 | 13.5,24.67 18.11,19.38 | 18.11,19.38 19.59,17.69 | R21.1 9.05,32.67 | 9.05,32.67 10.7,29.7 12.42,26.61 | 12.42,26.61 13.5,24.67 | v17.18,18.45 18.11,19.38 | v11.34,25.94 12.42,26.61 | R22.1 6.89,41.69 | 6.89,41.69 8.51,34.95 | 8.51,34.95 9.05,32.67 | v7.15,34.58 8.51,34.95 | 6.88,47.6 6.85,47.63 6.85,51.21 | 6.85,51.21 6.85,51.28 6.25,53.09 | 6.88,47.6 6.26,46.5 6.59,44.1 6.56,44.09 | 6.56,44.09 6.89,41.69 | v4.86,43.85 6.56,44.09 | R24.1 6.89,60.1 | R25.1 9.94,68.74 | 9.94,68.74 7.61,62.15 | 7.61,62.15 6.89,60.1 | v4.61,53.37 5.93,53.15 6.25,53.09 | v6.26,62.64 7.61,62.15 | R26.1 14.64,76.87 | 14.64,76.87 11,70.57 | 11,70.57 9.94,68.74 | v9.81,71.41 11,70.57 | R27.1 20.99,83.47 | 20.99,83.47 16.13,78.42 | 16.13,78.42 14.64,76.87 | v15.27,79.28 16.13,78.42 | R28.1 28.61,88.68 | 28.61,88.68 22.85,84.74 | 22.85,84.74 20.99,83.47 | v22.13,85.89 22.85,84.74 | R29.1 37.12,92.49 | 37.12,92.49 30.68,89.61 | 30.68,89.61 28.61,88.68 | v30.13,90.84 30.68,89.61 | R30.1 46.26,94.01 | 46.26,94.01 39.4,92.87 | 39.4,92.87 37.12,92.49 | v39.15,94.01 39.4,92.87 | v47.66,94.27 46.26,94.01 | v90.08,28.61 88.99,29.34 | v32.8,7.91 33.37,9.06 | 93.45,49.96 93.43,49.94 84.62,49.94 84.62,52.23 | 84.49,52.36 81.82,52.36 81.69,52.48 53.75,52.48 SV2.5 | 6.89,60.1 6.25,53.09 | R23.1 4.56,51.21 6.85,51.21 | 6.88,47.6 6.88,47.58 13.75,47.58 15.48,47.58 v15.65,47.4
LED_IN  (via drill 0.35)
  Top 0.508: LED1.4-DIN 55.84,96.55 51.47,96.55 51.19,96.27 51.19,95.16 50.96,94.93 v50.96,94.52 | v83.79,53.37 81.88,51.47 v63.41,51.47
  Bottom 0.508: v50.96,94.52 52.74,92.74 57.61,92.74 58.16,92.59 67.4,89.42 67.71,89.28 74.73,85.31 76.41,83.98 83.01,77.76 84.15,76.54 87.04,72.32 88.89,68.77 90.58,62.64 90.58,56.29 87.66,53.37 v83.79,53.37 | v63.41,51.47 62.77,50.83 62.77,48.8 61.37,47.4 52.1,47.4 51.21,48.29 51.21,49.94 SV2.7
LED_OUT  (via drill 0.35)
  Top 0.508: v39.15,51.47 18.32,51.47 v16.54,53.25 | v41.05,91.85 LED30.2-DOUT
  Bottom 0.508: SV2.8 48.67,47.4 41.05,47.4 39.15,49.31 v39.15,51.47 | v16.54,53.25 10.19,53.25 8.03,55.41 8.03,61.36 8.24,61.93 8.33,62.18 8.33,62.19 10.54,68.46 11.55,70.21 11.7,70.36 11.7,70.47 15.17,76.47 16.6,77.96 | 16.6,77.96 | 16.6,77.96 16.8,78.15 16.8,78.16 21.09,82.62 29.47,88.34 30.95,89 31.02,89.03 v41.05,91.85
N$1
  Top 0.508: LED1.2-DOUT 55.67,95.29 56.38,96 59.21,96 60.22,95.79 60.57,95.43 62.89,95.43 63.53,94.79 64.42,94.79 65.12,95.49 LED2.4-DIN
N$2
  Top 0.508: LED3.4-DIN 76.22,90.98 72.48,90.98 70.82,92.65 69.52,92.65 68.58,93.07 68.09,93.56 61.97,93.56 LED2.2-DOUT
N$3
  Top 0.508: LED4.4-DIN 83.58,85.19 80.42,85.19 77.97,87.64 77.14,88.25 76.06,89.32 71.65,89.32 LED3.2-DOUT
N$4
  Top 0.508: LED5.4-DIN 89.24,78.08 87.61,78.08 85.2,80.49 85.2,80.99 84.51,81.76 82.9,83.37 80.39,83.37 LED4.2-DOUT
N$6
  Top 0.508: LED7.4-DIN 98.02,58.3 95.48,60.84 95.48,63.27 94.78,63.97 94.46,64.95 94.46,65.86 90.42,69.9 LED6.2-DOUT
N$8
  Top 0.305: U1.14 14.77,51.34 15.91,50.2 41.05,50.2 41.31,50.2 SV2.13
N$9
  Top 0.305: U1.13 15.42,51.33 16.1,50.66 39.86,50.66 41.69,52.48 43.59,52.48 SV2.11
N$10
  Top 0.305: U2.13 84.47,48.49 84.16,48.8 60.88,48.8 59.13,47.05 54.11,47.05 SV2.6
N$11
  Top 0.305: U2.14 85.12,48.49 84.35,49.26 60.69,49.26 58.94,47.51 55.38,47.51 55.02,47.86 SV2.4
N$12
  Top 0.508: LED8.4-DIN 98.59,48.99 96.72,50.87 96.72,54.34 96.61,55.37 96.61,57.08 93.81,59.88 LED7.2-DOUT
N$13
  Top 0.305: U2.11 85.12,52.62 85.12,52.02 83.73,50.63 60.69,50.63 58.89,52.43 55.41,52.43 55.02,52.05 SV2.3
N$14
  Top 0.305: U2.10 85.77,51.89 84.06,50.17 58.61,50.17 SV2.1
N$15
  Top 0.305: U1.11 14.77,48.32 15.27,48.83 39.75,48.83 41.42,47.15 45.88,47.15 SV2.10
N$16
  Top 0.305: U1.10 14.12,48.51 14.89,49.28 39.94,49.28 41.61,47.61 43.8,47.61 SV2.12
N$37
  Top 0.508: LED8.2-DOUT 95.29,49.42 96.72,48 96.72,45.55 96.61,44.52 96.04,43.96 96.04,40.57 97.04,39.57 LED9.4-DIN
N$38
  Top 0.508: LED9.2-DOUT 94.79,39.08 94.97,38.9 94.97,36.11 94.78,35.92 94.46,34.94 94.46,33.59 93.43,32.56 93.43,31.63 LED10.4-DIN
N$39
  Top 0.508: LED5.2-DOUT 87.75,76.01 88.3,76.01 90.37,73.93 90.37,73.88 90.88,72.99 92.34,71.53 92.34,69.95 92.96,69.33 93.6,69.33 LED6.4-DIN
N$40
  Top 0.508: LED11.2-DOUT 86.55,23.72 86.55,20.24 85.2,18.9 84.51,18.13 82.2,15.82 82.2,13.67 LED12.4-DIN
N$41
  Top 0.508: LED12.2-DOUT 79.84,15.62 79.84,14.49 78.04,12.69 77.97,12.24 77.14,11.64 76.25,11.64 74.29,9.67 74.29,8.69 LED13.4-DIN
N$42
  Top 0.508: LED13.2-DOUT 74.37,11.85 71.88,9.36 71.8,9.03 70.65,8.37 69.52,7.24 68.58,6.82 67.66,5.9 65.81,5.9 62.86,2.95 LED14.4-DIN
N$43
  Top 0.508: LED15.4-DIN 53.74,1.32 56.31,3.89 59.21,3.89 60.22,4.1 61.53,4.1 64.97,7.54 LED14.2-DOUT
N$44
  Top 0.508: LED10.2-DOUT 91.67,32.99 91.67,27.69 90.88,26.9 90.37,26.01 88.58,24.23 88.58,20.11 LED11.4-DIN
N$45
  Top 0.508: LED16.2-DOUT 44.22,4.6 43.51,3.89 40.68,3.89 39.67,4.1 39.32,4.46 37,4.46 36.36,5.1 35.47,5.1 34.77,4.4 LED17.4-DIN
N$46
  Top 0.508: LED18.4-DIN 23.67,8.9 27.41,8.9 29.07,7.24 30.37,7.24 31.31,6.82 31.8,6.33 37.92,6.33 LED17.2-DOUT
N$47
  Top 0.508: LED19.4-DIN 16.31,14.69 19.47,14.69 21.92,12.24 22.75,11.64 23.82,10.56 28.24,10.56 LED18.2-DOUT
N$48
  Top 0.508: LED20.4-DIN 10.64,21.82 12.3,21.82 14.69,19.42 14.69,18.9 15.38,18.13 16.99,16.52 19.5,16.52 LED19.2-DOUT
N$49
  Top 0.508: LED16.4-DIN 44.36,1.81 45.72,3.16 46.57,3.16 46.77,2.97 52.55,2.97 54.67,5.09 LED15.2-DOUT
N$50
  Top 0.508: LED22.4-DIN 1.87,41.59 4.41,39.05 4.41,36.62 5.11,35.92 5.43,34.94 5.43,34.03 9.47,29.99 LED21.2-DOUT
N$51
  Top 0.508: LED23.4-DIN 1.29,50.9 3.17,49.02 3.17,45.55 3.28,44.52 3.28,42.81 6.07,40.01 LED22.2-DOUT
N$52
  Top 0.508: LED23.2-DOUT 4.59,50.47 3.17,51.89 3.17,54.34 3.28,55.37 3.85,55.93 3.85,59.32 2.85,60.32 LED24.4-DIN
N$53
  Top 0.508: LED24.2-DOUT 5.1,60.81 4.92,60.98 4.92,63.78 5.11,63.97 5.43,64.95 5.43,66.3 6.46,67.33 6.46,68.25 6.46,68.26 LED25.4-DIN
N$54
  Top 0.508: LED20.2-DOUT 12.14,23.88 11.59,23.88 10.58,24.9 10.58,25.54 10.19,25.93 9.52,26.11 9.01,27 7.58,28.43 7.58,29.95 6.96,30.57 6.28,30.57 LED21.4-DIN
N$55
  Top 0.508: LED26.2-DOUT 13.34,76.17 13.34,79.64 14.69,80.99 15.38,81.76 17.69,84.07 17.69,86.22 LED27.4-DIN
N$56
  Top 0.508: LED27.2-DOUT 20.05,84.27 20.05,85.4 21.85,87.2 21.92,87.64 22.75,88.25 23.64,88.25 25.6,90.22 25.6,91.2 LED28.4-DIN
N$57
  Top 0.508: LED28.2-DOUT 25.52,88.04 28.01,90.53 28.09,90.86 29.23,91.52 30.37,92.65 31.31,93.07 32.26,93.07 33.13,93.94 33.74,93.98 34.31,94.63 36.62,96.94 LED29.4-DIN
N$58
  Top 0.508: LED30.4-DIN 44.62,96 40.68,96 39.67,95.79 38.36,95.79 34.92,92.35 LED29.2-DOUT
N$59
  Top 0.508: LED25.2-DOUT 8.22,66.9 8.22,72.2 9.01,72.99 9.52,73.88 11.3,75.66 11.3,79.78 LED26.4-DIN
VCC  (via drill 0.35)
  Top 0.305: v94.15,47.66 94.15,46.01 93.76,45.63 91.73,45.63 91.6,45.75 91.6,46.3 U2.24
  Top 0.406: 8.03,53.57 U1.24
  Top 0.508: v5.67,52.18 5.67,52.51 6.74,53.58 8.03,53.58 8.03,53.57 8.03,52.48 8.67,51.85 v8.92,51.85
  Top 1.27: LED1.1-VDD v53.71,97.82 | LED2.1-VDD v63.98,95.86 | LED3.1-VDD v72.94,92.1 | LED4.1-VDD v81.29,86.32 | LED5.1-VDD v88.05,79.16 | LED6.1-VDD v93.39,70.38 | LED7.1-VDD v96.61,61.31 | LED8.1-VDD v97.95,51.21 | LED9.1-VDD v97.12,41.01 | LED10.1-VDD v94.55,32.1 | LED11.1-VDD v89.7,22.99 | LED12.1-VDD v83.25,15.34 | LED13.1-VDD v75.4,9.21 | LED14.1-VDD v66.28,4.77 | LED15.1-VDD v56.36,2.35 | LED16.1-VDD v46.18,2.07 | LED17.1-VDD v35.91,4.03 | LED18.1-VDD v26.94,7.79 | LED19.1-VDD v18.6,13.57 | LED20.1-VDD v11.85,20.74 | LED21.1-VDD v6.52,29.51 | LED22.1-VDD v3.28,38.58 | LED23.1-VDD v1.94,48.67 | LED24.1-VDD v2.76,58.87 | LED25.1-VDD v5.34,67.79 | LED26.1-VDD v10.19,76.9 | LED27.1-VDD v16.64,84.55 | LED28.1-VDD v24.49,90.68 | LED29.1-VDD v33.24,94.99 | LED30.1-VDD PT30.C
  Bottom 0.305: v94.15,47.66 97.7,47.66 97.95,47.4
  Bottom 0.508: PT23.C v1.94,48.67 | v75.4,9.21 PT13.C | PT22.C v3.28,38.58 | v5.67,52.18 5.37,52.48 1.94,52.48 | v8.92,51.85 37.88,51.85 38.51,52.48 46.13,52.48 SV2.9
  Bottom 1.27: PT1.C v53.71,97.82 57.48,97.42 PT2.C v63.98,95.86 PT3.C v72.94,92.1 PT4.C v81.29,86.32 PT5.C v88.05,79.16 PT6.C v93.39,70.38 PT7.C v96.61,61.31 PT8.C v97.95,51.21 97.95,47.4 PT9.C v97.12,41.01 PT10.C v94.55,32.1 PT11.C v89.7,22.99 PT12.C v83.25,15.34 PT13.C PT14.C v66.28,4.77 PT15.C v56.36,2.35 PT16.C v46.18,2.07 PT17.C v35.91,4.03 PT18.C v26.94,7.79 PT19.C v18.6,13.57 PT20.C v11.85,20.74 PT21.C v6.52,29.51 PT22.C PT23.C v1.94,48.67 1.94,52.48 PT24.C v2.76,58.87 PT25.C v5.34,67.79 PT26.C v10.19,76.9 PT27.C v16.64,84.55 PT28.C v24.49,90.68 PT29.C v33.24,94.99 PT30.C